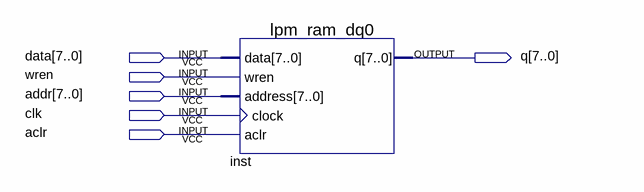
[diagram p0: schematic sheet]
// Quartus schematic ram256.bdf as structural Verilog: 1 symbols, 6 pins
module ram256 (
  input  [7:0] data,
  input  wren,
  input  [7:0] addr,
  input  clk,
  input  aclr,
  output [7:0] q
);

  lpm_ram_dq0 inst (.data(data), .wren(wren), .address(addr), .clock(clk), .aclr(aclr), .q(q));
endmodule
